# Altium schematic sheet Power.SchDoc
size A4
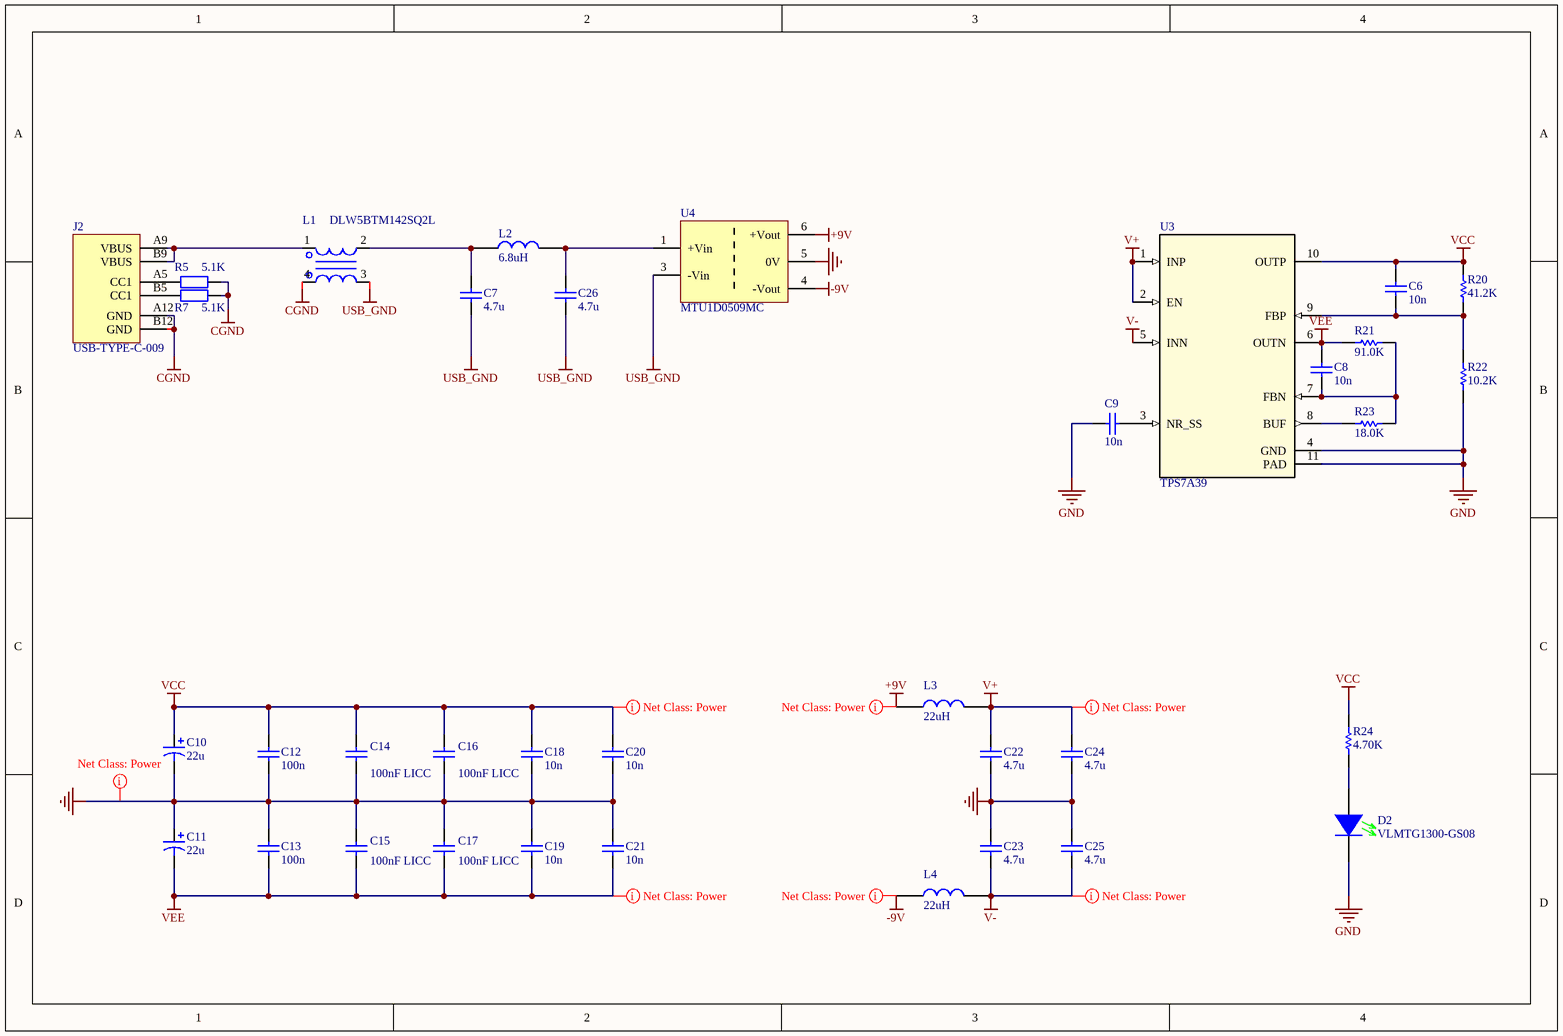
[diagram p0: Power.SchDoc]

## Parts
C6  10n  [CAPC0402(1005)50_M]
C7  4.7u  [CAPC0805(2012)100_M]
C8  10n  [CAPC0402(1005)50_M]
C9  10n  [CAPC0402(1005)50_M]
C10  22u  [KEMET B_M]
C11  22u  [KEMET B_M]
C12  100n  [CAPC0603(1608)100_M]
C13  100n  [CAPC0603(1608)100_M]
C14  value 100nF LICC  [CAPC0306_M]  (hidden comment: 100n LICC)
C15  value 100nF LICC  [CAPC0306_M]  (hidden comment: 100n LICC)
C16  value 100nF LICC  [CAPC0306_M]  (hidden comment: 100n LICC)
C17  value 100nF LICC  [CAPC0306_M]  (hidden comment: 100n LICC)
C18  10n  [CAPC0402(1005)50_M]
C19  10n  [CAPC0402(1005)50_M]
C20  10n  [CAPC0402(1005)50_M]
C21  10n  [CAPC0402(1005)50_M]
C22  4.7u  [CAPC0805(2012)100_M]
C23  4.7u  [CAPC0805(2012)100_M]
C24  4.7u  [CAPC0805(2012)100_M]
C25  4.7u  [CAPC0805(2012)100_M]
C26  4.7u  [CAPC0805(2012)100_M]
D2  VLMTG1300-GS08  [LED0603(1608)_M]
J2  value USB-TYPE-C-009  [GCT_USB4125-GF-A_REVA2]  (hidden comment: USB- C)
L1  value DLW5BTM142SQ2L  [SDCW3225]  (hidden comment: Choke)
L2  value 6.8uH  [SML-1210]  (hidden comment: Inductor)
L3  value 22uH  [SML-1210]  (hidden comment: Inductor)
L4  value 22uH  [SML-1210]  (hidden comment: Inductor)
R5  value 5.1K  [SMR-0402]  (hidden comment: Res)
R7  value 5.1K  [SMR-0402]  (hidden comment: Res)
R20  41.2K  [RESC0402(1005)_M]
R21  91.0K  [RESC0402(1005)_M]
R22  10.2K  [RESC0402(1005)_M]
R23  18.0K  [RESC0402(1005)_M]
R24  4.70K  [RESC0603(1608)_M]
U3  TPS7A39  [DSC0010J_NV]
U4  MTU1D0509MC  [MTU1D0509MC]

## Nets
+9V: L3.1 U4.6(+Vout)
-9V: L4.1 U4.4(-Vout)
CGND: J2.A12(GND) J2.B12(GND) L1.4 R5.1 R7.1
GND: C9.2 C10.2 C11.1 C12.2 C13.1 C14.2 C15.1 C16.2 C17.1 C18.2 C19.1 C20.2 C21.1 C22.2 C23.1 C24.2 C25.2 D2.2(K) R22.2 U3.4(GND) U3.11(PAD) U4.5(0V)
USB_GND: C7.2 C26.2 L1.3 U4.3(-Vin)
V+: C22.1 C24.1 L3.2 U3.1(INP) U3.2(EN)
V-: C23.2 C25.1 L4.2 U3.5(INN)
VCC: C6.2 C10.1 C12.1 C14.1 C16.1 C18.1 C20.1 R20.1 R24.1 U3.10(OUTP)
VEE: C8.2 C11.2 C13.2 C15.2 C17.2 C19.2 C21.2 R21.2 U3.6(OUTN)
NetC6_1: C6.1 R20.2 R22.1 U3.9(FBP)
NetC7_1: C7.1 L1.2 L2.1
NetC8_1: C8.1 R21.1 R23.1 U3.7(FBN)
NetC9_1: C9.1 U3.3(NR_SS)
NetC26_1: C26.1 L2.2 U4.1(+Vin)
NetD2_1: D2.1(A) R24.2
NetJ2_A5: J2.A5(CC1) R5.2
NetJ2_A9: J2.A9(VBUS) J2.B9(VBUS) L1.1
NetJ2_B5: J2.B5(CC1) R7.2
NetR23_2: R23.2 U3.8(BUF)

## Layout directives
net class Power: +9V, -9V, GND, V+, V-, VCC, VEE

## Library data of the parts
C6 C8 C9 = GRM1555C1E103JE01: CAP CER 10NF±5% 25V C0G 0402; Manufacturer: Murata; Manufacturer Part Number: GRM1555C1E103JE01D; Tolerance: ±5%; Capacitance: 10nF; Part Number: GRM1555C1E103JE01; Value: 10n; Temperature Coefficient: C0G
C7 C22-C26 = GRM21BZ71H475KE15K: CAP CER 4.7UF 50V X7R 0805; Manufacturer: Murata; Supplier 1: Digi-Key; Manufacturer Part Number: GRM21BZ71H475KE15K; Stock 1: 134344; Pricing 1: 1=0.6, 10=0.444, 50=0.3554, 100=0.3047, 500=0.2412, 1000=0.20311, 2500=0.19042, 5000=0.17772 (USD); ComponentLink1URL: https://datasheet.octopart.com/GRM21BZ71H475KE15K-Murata-datasheet-149523520.pdf?src-supplier=Newark; ComponentLink1Description: https://datasheet.octopart.com/GRM21BZ71H475KE15K-Murata-datasheet-149523520.pdf?src-supplier=Newark; Supplier Part Number 1: 490-GRM21BZ71H475KE15KCT-ND; RoHS Compliant: Yes; ComponentLink2URL: https://datasheet.octopart.com/GRM21BZ71H475KE15K-Murata-datasheet-165579666.pdf?src-supplier=TME; ComponentLink2Description: https://datasheet.octopart.com/GRM21BZ71H475KE15K-Murata-datasheet-165579666.pdf?src-supplier=TME; Supplier 2: Mouser; Supplier Part Number 2: 81-GRM21BZ71H475KE5K
C10 C11 = T491B226K016AT: CAP TANT 22UF 10% 16V 1411; Manufacturer: KEMET; Dielectric Material: Tantalum; ESR (Equivalent Series Resistance): 2.2R; Polarity: Polar; Dissipation Factor: 6%; Life (Hours): 2000Hour; Leakage Current: 3.6uA; Ripple Current: 197mA; Supplier 1: Digikey; Supplier Part Number 1: 399-8312-6-ND; Manufacturer Part Number: T491B226K016AT; Stock 1: 3174; Pricing 1: 1=0.64, 10=0.433, 50=0.3444, 100=0.2844, 500=0.2222, 1000=0.18887 (USD); Mount: Surface Mount,PCB; Case/Package: 1411; Case Code (Imperial): 1411; Case Code (Metric): 3528; Min Operating Temperature: -55°C; Max Operating Temperature: 125°C; Capacitance: 22uF; Tolerance: 10%; Packaging: Tape and Reel; Construction: Flat; Voltage Rating: 16V; Series: T491; Termination: SMD/SMT; Package Quantity: 1; Voltage Rating (DC): 16V; Features: General Purpose; Voltage: 16V; Length: 3.5mm; Width: 2.8mm; Height: 1.9mm; Depth: 2.8mm; Height - Seated (Max): 0.083inch; Radiation Hardening: No; RoHS Compliant: Yes; Lead Free: Lead Free; Reach SVHC Compliant: Yes; ComponentLink1URL: https://datasheet.ciiva.com/8079/kem-t2005-t491-8079799.pdf?src-supplier=Element14; ComponentLink1Description: https://datasheet.ciiva.com/8079/kem-t2005-t491-8079799.pdf?src-supplier=Element14; ComponentLink2URL: https://datasheet.ciiva.com/7696/1854511-7696325.pdf?src-supplier=Element14; ComponentLink2Description: https://datasheet.ciiva.com/7696/1854511-7696325.pdf?src-supplier=Element14; ComponentLink3URL: https://datasheet.ciiva.com/7696/1446014-7696326.pdf?src-supplier=Element14; ComponentLink3Description: https://datasheet.ciiva.com/7696/1446014-7696326.pdf?src-supplier=Element14; ComponentLink4URL: https://datasheet.ciiva.com/5934/1446014-5934574.pdf?src-supplier=Farnell; ComponentLink4Description: https://datasheet.ciiva.com/5934/1446014-5934574.pdf?src-supplier=Farnell; ComponentLink5URL: https://datasheet.ciiva.com/6247/kem-t2005-t491-6247978.pdf?src-supplier=Digikey; ComponentLink5Description: https://datasheet.ciiva.com/6247/kem-t2005-t491-6247978.pdf?src-supplier=Digikey; ComponentLink6URL: https://datasheet.ciiva.com/6247/kem-t2005-t491-6247977.pdf?src-supplier=Digikey; ComponentLink6Description: https://datasheet.ciiva.com/6247/kem-t2005-t491-6247977.pdf?src-supplier=Digikey; ComponentLink7URL: https://datasheet.ciiva.com/6247/kem-t2005-t491-6247979.pdf?src-supplier=Digikey; ComponentLink7Description: https://datasheet.ciiva.com/6247/kem-t2005-t491-6247979.pdf?src-supplier=Digikey; ComponentLink8URL: https://datasheet.ciiva.com/14589/70095774-14589317.pdf?src-supplier=Allied+Electronics; ComponentLink8Description: https://datasheet.ciiva.com/14589/70095774-14589317.pdf?src-supplier=Allied+Electronics; ComponentLink9URL: https://datasheet.ciiva.com/14600/70095774-14600348.pdf?src-supplier=Allied+Electronics; ComponentLink9Description: https://datasheet.ciiva.com/14600/70095774-14600348.pdf?src-supplier=Allied+Electronics; ComponentLink10URL: https://datasheet.ciiva.com/12911/kem-t2005-t491-12911727.pdf?src-supplier=Mouser; ComponentLink10Description: https://datasheet.ciiva.com/12911/kem-t2005-t491-12911727.pdf?src-supplier=Mouser; ComponentLink11URL: https://datasheet.ciiva.com/29244/458294-da-01-en-tantal-kondensator-t491b226k016at-29244581.pdf?src-supplier=Conrad; ComponentLink11Description: https://datasheet.ciiva.com/29244/458294-da-01-en-tantal-kondensator-t491b226k016at-29244581.pdf?src-supplier=Conrad; Supplier 2: Mouser; Supplier Part Number 2: 80-T491B226K016; Number of Pins: 2; Weight: 0.002293oz; Failure Rate: 0.001%; Lead Pitch: 1.9mm
C12 C13 = CC0603KRX7R9BB104: CAPACITOR CERAMIC, 0.1UF, 50V, X7R, 10%, 0603; Manufacturer: Yageo; Capacitance: 100nF; Supplier 1: Digi-Key; Manufacturer Part Number: CC0603KRX7R9BB104; Stock 1: 0; Pricing 1: 1=0.1, 10=0.066, 50=0.036, 100=0.0293, 500=0.02094, 1000=0.01646 (USD); Mount: Surface Mount; Case/Package: 0603; Number of Pins: 2; Case Code (Metric): 1608; Case Code (Imperial): 0603; Dielectric Material: Ceramic; Min Operating Temperature: -55°C; Max Operating Temperature: 125°C; Package Quantity: 1; Voltage Rating: 50V; Tolerance: 10%; Packaging: Tape and Reel; Dielectric: X7R; Termination: SMD/SMT; Voltage: 50V; Length: 1.6mm; Height: 0.8mm; Width: 0.031inch; Thickness: 0.035inch; Depth: 0.8mm; Radiation Hardening: No; REACH SVHC: No SVHC; Lead Free: Lead Free; Halogen Free: Halogen Free; ComponentLink1URL: http://www.yageo.com/documents/recent/UPY-GPHC_X7R_6.3V-to-50V_18.pdf?src-supplier=Digi-Key; ComponentLink1Description: http://www.yageo.com/documents/recent/UPY-GPHC_X7R_6.3V-to-50V_18.pdf?src-supplier=Digi-Key; ComponentLink2URL: http://www.farnell.com/datasheets/1489800.pdf?src-supplier=Element14; ComponentLink2Description: http://www.farnell.com/datasheets/1489800.pdf?src-supplier=Element14; ComponentLink3URL: http://www.yageo.com/documents/recent/UPY-GPHC_X7R_6.3V-to-50V_8.pdf?src-supplier=Avnet+Europe; ComponentLink3Description: http://www.yageo.com/documents/recent/UPY-GPHC_X7R_6.3V-to-50V_8.pdf?src-supplier=Avnet+Europe; ComponentLink4URL: http://www.farnell.com/datasheets/2167236.pdf?src-supplier=Element14; ComponentLink4Description: http://www.farnell.com/datasheets/2167236.pdf?src-supplier=Element14; ComponentLink5URL: http://www.farnell.com/datasheets/1489800.pdf?src-supplier=Farnell; ComponentLink5Description: http://www.farnell.com/datasheets/1489800.pdf?src-supplier=Farnell; Supplier 2: Mouser; Supplier Part Number 1: 311-1344-1-ND; Supplier Part Number 2: 603-CC603KRX7R9BB104; LCSC PART #: C14663
C14-C17 = TWK107B7104MVHT: CAP CER 0.1UF 25V X7R 0306; Manufacturer: YAGEO; Manufacturer PartN: CL0306KRX7R6BB104; Parameters: 100nF X7R +/-10% 0306; Distributor: LCSC; Distributor PartN: C2217498
  C15-C17: ComponentLink1URL: http://ds.yuden.co.jp/TYCOMPAS/ut/detail.do?productNo=TWK107B7104MVHT&amp;fileName=TWK107B7104MVHT_SS&amp;mode=specSheetDownload&src-supplier=Digi-Key; ComponentLink1Description: http://ds.yuden.co.jp/TYCOMPAS/ut/detail.do?productNo=TWK107B7104MVHT&amp;fileName=TWK107B7104MVHT_SS&amp;mode=specSheetDownload&src-supplier=Digi-Key; ComponentLink2URL: https://ds.yuden.co.jp/TYCOMPAS/ut/detail?pn=TWK107B7104MVHT &amp;u=M&src-supplier=Digi-Key; ComponentLink2Description: https://ds.yuden.co.jp/TYCOMPAS/ut/detail?pn=TWK107B7104MVHT &amp;u=M&src-supplier=Digi-Key
C18 = GRM155R71H103KA88: CAP CER 10NF±10% 50V X7R 0402; Manufacturer: Murata; Manufacturer PartN: GRM155R71H103KA88D; Capacitance: 10nF; Tolerance: ±10%; Part Number: GRM155R71H103KA88; Value: 10n; Temperature Coefficient: X7R
C19-C21 = GRM155R71H103KA88: CAP CER 10NF±10% 50V X7R 0402; Manufacturer: Murata; Manufacturer Part Number: GRM155R71H103KA88D; Capacitance: 10nF; Tolerance: ±10%; Part Number: GRM155R71H103KA88; Value: 10n; Temperature Coefficient: X7R
D2 = VLMTG1300-GS08: LED GREEN 0603 SMD; Manufacturer: Vishay Semiconductors; Viewing Angle: 130°; Lens Style: Rectangular,Clear; Wavelength: 525nm; Forward Voltage: 3.2V; Luminous Intensity: 450mcd; Forward Current: 20mA; Power Rating: 75mW; Number of Elements: 1; Power Dissipation: 76mW; Supplier 1: Digi-Key; Supplier Part Number 1: VLMTG1300-GS08CT-ND; Manufacturer Part Number: VLMTG1300-GS08; Stock 1: 156996; Pricing 1: 1=0.46, 10=0.305, 100=0.2033, 500=0.1406, 1000=0.11716 (USD); Mount: Surface Mount; Case/Package: 0603; Number of Pins: 2; Color: Green; Case Code (Metric): 1608; Case Code (Imperial): 0603; Contact Plating: Tin,Matte; Min Operating Temperature: -35°C; Max Operating Temperature: 85°C; Package Quantity: 1; Packaging: Tape and Reel; Illumination Color: Green; Dominant Wavelength: 525nm; Test Current: 20mA; Number of LEDs: 1; Max Power Dissipation: 76mW; Series: CHipLED; Length: 1.6mm; Width: 0.8mm; Height: 0.8mm; Depth: 0.8mm; Radiation Hardening: No; Lead Free: Lead Free; RoHS Compliant: Yes; ComponentLink1URL: https://datasheet.ciiva.com/26322/vlmo1300-26322149.pdf?src-supplier=Element14; ComponentLink1Description: https://datasheet.ciiva.com/26322/vlmo1300-26322149.pdf?src-supplier=Element14; ComponentLink2URL: https://datasheet.ciiva.com/8028/vlmo1300-8028077.pdf?src-supplier=Element14; ComponentLink2Description: https://datasheet.ciiva.com/8028/vlmo1300-8028077.pdf?src-supplier=Element14; ComponentLink3URL: https://datasheet.ciiva.com/16510/vlmo1300-16510989.pdf?src-supplier=Future+Electronics; ComponentLink3Description: https://datasheet.ciiva.com/16510/vlmo1300-16510989.pdf?src-supplier=Future+Electronics; ComponentLink4URL: https://datasheet.ciiva.com/2115/vlmo1300-2115107.pdf?src-supplier=Digi-Key; ComponentLink4Description: https://datasheet.ciiva.com/2115/vlmo1300-2115107.pdf?src-supplier=Digi-Key; ComponentLink5URL: https://datasheet.ciiva.com/2115/vlmo1300-2115108.pdf?src-supplier=Digi-Key; ComponentLink5Description: https://datasheet.ciiva.com/2115/vlmo1300-2115108.pdf?src-supplier=Digi-Key; ComponentLink6URL: https://datasheet.ciiva.com/2115/vlmo1300-2115106.pdf?src-supplier=Digi-Key; ComponentLink6Description: https://datasheet.ciiva.com/2115/vlmo1300-2115106.pdf?src-supplier=Digi-Key; Supplier 2: Mouser; Supplier Part Number 2: 78-VLMTG1300-GS08
J2 = USB- C: USB Type C 3.1 connector; Manufacturer: DEALON; Parameters: USB Type C 3.1 9 pins; Distributor: LCSC; Distributor PartN: C2927029; Manufacturer PartN: USB-TYPE-C-009; DistributorAlt PartN: N/A; DistributorAlt: N/A
L1 = Choke: Common Mode Choke Coils; Manufacturer: Murata; Parameters: Common Mode Filters 1.4K@100MHz 56mOhm; Distributor: LCSC; Distributor PartN: C91596; Manufacturer PartN: DLW5BTM142SQ2L; DistributorAlt: N/A; DistributorAlt PartN: N/A
L2 = Inductor: Manufacturer: TDK; Manufacturer PartN: NLCV32T-6R8M-EF; Parameters: FIXED IND 6.8uH +/-20% 270mohm; Distributor: LCSC; Distributor PartN: C250230
L3 L4 = Inductor: Manufacturer: TDK; Manufacturer PartN: NLCV32T-220K-EF; Parameters: FIXED IND 22uH 1.25 Ohm; Distributor: LCSC; Distributor PartN: C250233
R5 R7 = Res: Resistor; Manufacturer: YAGEO; Price: N/A; Distributor: LCSC; Distributor PartN: C105872
R20 = RESC0402-41K2-1pct: RES 41.2K OHM 1% 1/16W 0402; Manufacturer 1: Yageo; Manufacturer Part Number 1: RC0402FR-0741K2L; Ohms: 41200; Part Number: RESC0402-41K2-1pct; Value: 41.2K; Manufacturer 2: Stackpole Electronics; Manufacturer Part Number 2: RMCF0402FT41K2; Manufacturer 3: Vishay Dale; Manufacturer Part Number 3: CRCW040241K2FKED; Manufacturer 4: Panasonic Electronic Components; Manufacturer Part Number 4: ERJ-2RKF4122X
R21 = RESC0402-91K0-1pct: RES 91.0K OHM 1% 1/16W 0402; Manufacturer 1: Yageo; Manufacturer Part Number 1: RC0402FR-0791KL; Ohms: 91000; Part Number: RESC0402-91K0-1pct; Value: 91.0K; Manufacturer 2: Stackpole Electronics; Manufacturer Part Number 2: RMCF0402FT91K0; Manufacturer 3: Vishay Dale; Manufacturer Part Number 3: CRCW040291K0FKED; Manufacturer 4: Panasonic Electronic Components; Manufacturer Part Number 4: ERJ-2RKF9102X
R22 = RESC0402-10K2-1pct: RES 10.2K OHM 1% 1/16W 0402; Manufacturer 1: Yageo; Manufacturer Part Number 1: RC0402FR-0710K2L; Ohms: 10200; Part Number: RESC0402-10K2-1pct; Value: 10.2K; Manufacturer 2: Stackpole Electronics; Manufacturer Part Number 2: RMCF0402FT10K2; Manufacturer 3: Vishay Dale; Manufacturer Part Number 3: CRCW040210K2FKED; Manufacturer 4: Panasonic Electronic Components; Manufacturer Part Number 4: ERJ-2RKF1022X
R23 = RESC0402-18K0-1pct: RES 18.0K OHM 1% 1/16W 0402; Manufacturer 1: Yageo; Manufacturer Part Number 1: RC0402FR-0718KL; Ohms: 18000; Part Number: RESC0402-18K0-1pct; Value: 18.0K; Manufacturer 2: Stackpole Electronics; Manufacturer Part Number 2: RMCF0402FT18K0; Manufacturer 3: Vishay Dale; Manufacturer Part Number 3: CRCW040218K0FKED; Manufacturer 4: Panasonic Electronic Components; Manufacturer Part Number 4: ERJ-2RKF1802X
R24 = RESC0603-4K70-1pct: RES 4.70K OHM 1% 1/10W 0603; Manufacturer 1: Yageo; Manufacturer Part Number 1: RC0603FR-074K7L; Ohms: 4700; Part Number: RESC0603-4K70-1pct; Value: 4.70K; Manufacturer 2: Stackpole Electronics; Manufacturer Part Number 2: RMCF0603FT4K70; Manufacturer 3: Vishay Dale; Manufacturer Part Number 3: CRCW06034K70FKEA; Manufacturer 4: Panasonic Electronic Components; Manufacturer Part Number 4: ERJ-3EKF4701V
U3 = TPS7A3901DSCR: IC REG LINEAR POS/NEG ADJ 10WSON; Mfr_Name: Texas Instruments; Output Type: Adjustable; Number of Regulators: 2; Max Input Voltage: 33V; Min Output Voltage: 0V; Max Output Voltage: -30V; Dropout Voltage: 500mV; Output Current: 150mA; Quiescent Current: 150uA; Max Supply Current: 904uA; Power Supply Rejection Ratio (PSRR): 69dB; Type: DEV; RefDes: RefDes; Copyright: Copyright (C) 2022 Ultra Librarian. All rights reserved.; Manufacturer_Part_Number: TPS7A3901DSCR; Supplier 1: Digi-Key; Manufacturer: Texas Instruments; Manufacturer Part Number: TPS7A3901DSCR; Stock 1: 0; Mount: Surface Mount; Min Operating Temperature: -40°C; Max Operating Temperature: 125°C; Packaging: Cut Tape; Series: -; ComponentLink1URL: http://www.ti.com/lit/ds/symlink/tps7a39.pdf?src-supplier=Digi-Key; ComponentLink1Description: http://www.ti.com/lit/ds/symlink/tps7a39.pdf?src-supplier=Digi-Key; ComponentLink2URL: http://www.ti.com/general/docs/suppproductinfo.tsp?distId=10&amp;gotoUrl=http%3A%2F%2Fwww.ti.com%2Flit%2Fgpn%2Ftps7a39&src-supplier=Digi-Key; ComponentLink2Description: http://www.ti.com/general/docs/suppproductinfo.tsp?distId=10&amp;gotoUrl=http%3A%2F%2Fwww.ti.com%2Flit%2Fgpn%2Ftps7a39&src-supplier=Digi-Key; Supplier 2: Mouser; Supplier Part Number 1: 296-TPS7A3901DSCRCT-ND; Supplier Part Number 2: 595-TPS7A3901DSCR
U4 = MTU1D0509MC: Isolated DC/DC 1W 5-> +/-9V; Manufacturer: Murata; Distributor: Digikey; Distributor PartN: 811-2376-ND; Manufacturer PartN: MTU1D0509MC; DistributorAlt PartN: N/A; DistributorAlt: N/A; Parameters: Isolated DC/DC 1W 5-> +/-9V; Value: MTU1D0509MC